# EAGLE board BT60-soldered (EAGLE 9.6.2), part 1 of 2
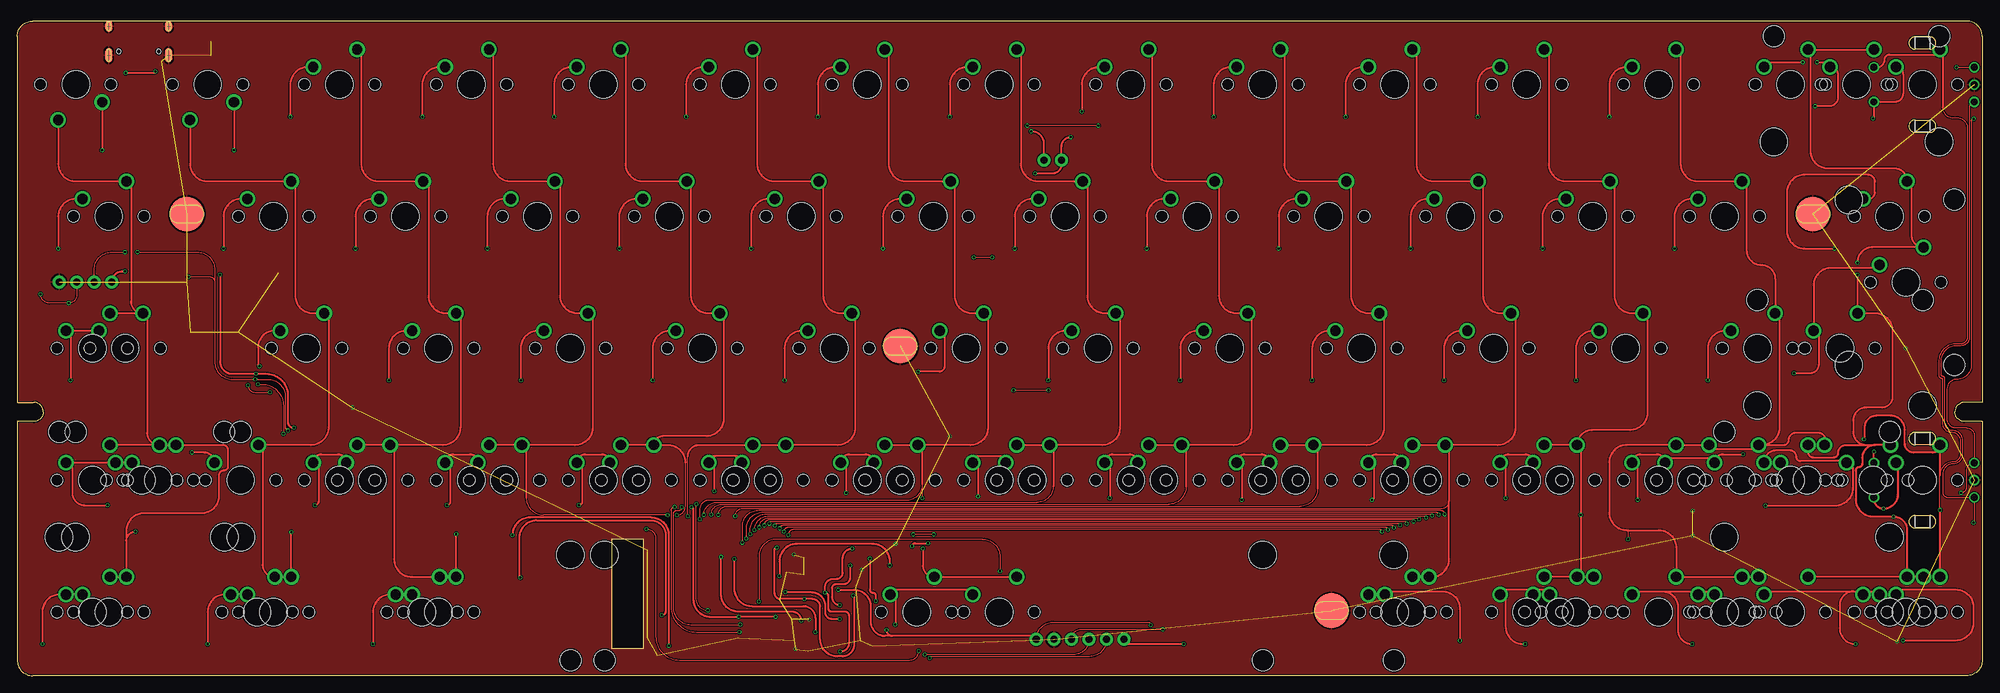
[diagram p2: board, top side]
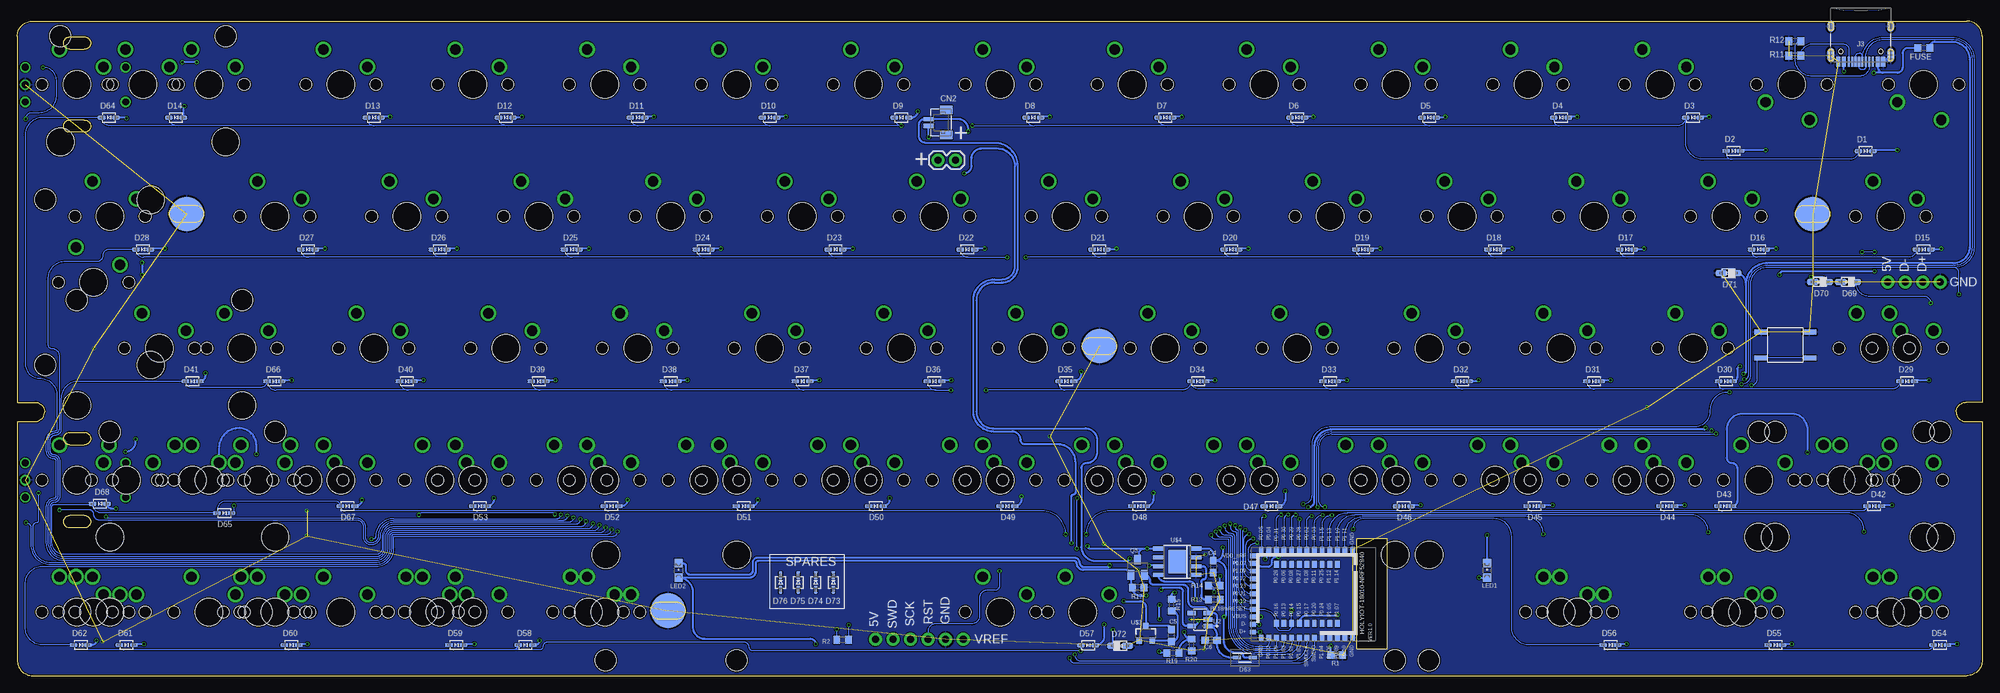
[diagram p3: board, bottom side, seen from below]

Size 283.78 x 94.59 mm. Coordinates in mm from the lower left corner, seen from the top.
Outline: 281.57,94.59 2.21,94.59 arc90 0,92.38 0,39.5 2.36,39.5 arc-90 3.76,38.1 arc-90 2.36,36.7 0,36.7 0,2.21 arc90 2.21,0 281.57,0 arc90 283.78,2.21 283.78,36.7 281.24,36.7 arc-90 279.84,38.1 arc-90 281.24,39.5 283.78,39.5 283.78,92.38 arc90 281.57,94.59
Copper layers (1*16): Top 0.035559375mm / dielectric 1.6mm / Bottom 0.035559375mm
Design rules "jlcpcb2layer": minimum track width 5mil, minimum drill 12mil, track to track 5mil, track to pad 5mil, pad to pad 5mil, via to via 5mil, smd to smd 5mil, copper to edge 8mil, drill to drill 6mil, minimum pad ring 5mil, minimum via ring 3mil, stop-mask expansion 2.5mil, vias tented up to drill 0mil, thermal gap 10mil

## Footprints (pad centres in the part's own frame; a part is rotated, then mirrored left to right if it is on the bottom)
CHERRY-SOLDER = drill 1.499: P$1 -3.81,2.54; P$2 2.54,5.08 | hole 3.988: 0,0 | hole 1.702: -5.08,0; 5.08,0
C0603 = smd 1.1 x 1: 1 -0.85,0; 2 0.85,0
BM02B-SRSS-TB = smd 0.6 x 1.55: 1 0.5,0; 2 -0.5,0 | smd 1.2 x 1.8: M1 1.8,-2.525; M2 -1.8,-2.525
SOD-323 = smd 1.14 x 0.52: A 1.04,0; C -1.04,0
SOD2713X115N = smd 1.125 x 0.5: 1 -1.162,0; 2 1.162,0
SOD-323' = smd 1.676 x 0.813: A 1.04,0; C -1.04,0
R0603 = smd 1 x 1.1: 1 -0.85,0; 2 0.85,0
PCBCOMPONENT_1 = smd 0.7 x 0.9: D+ 5.5,-7.8; D- 4.4,-7.8; P0.07 -4.4,-7.8; P0.12 -2.2,-7.8; P0.18 2.2,-7.8; P0.19 1.1,-7.8; P0.21 0,-7.8; P0.23 -1.1,-7.8; P1.09 -3.3,-7.8; VBUS 3.3,-7.8; VDD_NRF -5.5,-7.8 | smd 0.9 x 0.7: GND -6.35,6.6; GND1 6.35,-6.6; GND2 6.35,6.6; P0.02 -6.35,0; P0.03 -6.35,1.1; P0.04 -6.35,-5.5; P0.05 -6.35,-6.6; P0.09 6.35,4.4; P0.10 6.35,5.5; P0.22 6.35,-5.5; P0.28 -6.35,-1.1; P0.29 -6.35,-2.2; P0.30 -6.35,-3.3; P0.31 -6.35,-4.4; P1.00 6.35,-4.4; P1.01 6.35,-2.2; P1.02 6.35,-1.1; P1.03 6.35,-3.3; P1.04 6.35,2.2; P1.06 6.35,3.3; P1.10 -6.35,4.4; P1.11 -6.35,5.5; P1.13 -6.35,3.3; P1.15 -6.35,2.2; SWDCLK 6.35,0; SWDIO 6.35,1.1 | smd 1 x 0.7: P0.06 -4.25,-3.3; P0.08 -4.25,-2.2; P0.11 -4.25,1.1; P0.13 4.25,-3.3; P0.14 4.25,-2.2; P0.15 4.25,-1.1; P0.16 4.25,-4.4; P0.17 4.25,0; P0.25 -4.25,2.2; P0.26 -4.25,-4.4; P0.27 -4.25,-1.1; P1.05 4.25,3.3; P1.07 4.25,4.4; P1.08 -4.25,0; P1.12 -4.25,3.3; P1.14 -4.25,4.4 | smd 1 x 0.6: P0.20 4.25,1.1; P0.24 4.25,2.2
1X04_NO_SILK = drill 1.016 pad 1.88: 1 0,0; 2 2.54,0; 3 5.08,0; 4 7.62,0
SPARKFUN-CONNECTORS_USB-C-16P = smd 0.3 x 1.45: A5 -1.25,0; A6 -0.25,0; A7 0.25,0; A8 1.25,0; B5 1.75,0; B6 0.75,0; B7 -0.75,0; B8 -1.75,0 | smd 0.6 x 1.45: GND -3.225,0; GND2 3.225,0 | smd 1 x 2.1: SHLD1 -4.32,-0.915; SHLD2 4.32,-0.915 | smd 1 x 2.1 bottom: SHLD3 -4.32,-0.915; SHLD4 4.32,-0.915 | smd 1 x 1.6: SHLD5 -4.32,-5.095; SHLD8 4.32,-5.095 | smd 1 x 1.6 bottom: SHLD6 -4.32,-5.095; SHLD7 4.32,-5.095 | smd 0.55 x 1.45: VBUS1 -2.45,0; VBUS2 2.45,0 | hole 0.65: -2.89,-1.445; 2.89,-1.445
1X02 = drill 1.016 pad 1.88: 1 0,0; 2 2.54,0
CHIPLED_0805 = smd 1.2 x 1.2: A 0,-1.05; C 0,1.05
1X06_NO_SILK = drill 1.016 pad 1.88: 1 0,0; 2 2.54,0; 3 5.08,0; 4 7.62,0; 5 10.16,0; 6 12.7,0
SOT23 = smd 1 x 1.4: 1 -0.95,-1.1; 2 0.95,-1.1; 3 0,1.1
SOT95P285X140-5N = smd 1.35 x 0.6: 1 -1.185,0.95; 2 -1.185,0; 3 -1.185,-0.95; 4 1.185,-0.95; 5 1.185,0.95
CHERRY-ENCODER = drill 0.991: A -2.5,-7.5; B 2.5,-7.5; GND 0,-7.5; S1 -2.5,7; S2 2.5,7
SOT23-3 = smd 0.8 x 0.9: 1 -0.95,-1; 2 0.95,-1; 3 0,1.1
SOIC8 = smd 0.6 x 1.5: 1 -1.905,-2.75; 2 -0.635,-2.75; 3 0.635,-2.75; 4 1.905,-2.75; 5 1.905,2.75; 6 0.635,2.75; 7 -0.635,2.75; 8 -1.905,2.75 | smd 3.4 x 2.5: P$1 0,0
SMD-BUTTON = smd 2 x 0.75: A -3.5,1.875; B 3.5,1.875; C -3.5,-1.875; D 3.5,-1.875
2.5MM_ELONGATED = smd 5 x 5: P$1 0,0 | smd 5 x 5 bottom: P$2 0,0
STAB-2U = hole 3.988: -11.938,-8.255; 11.938,-8.255 | hole 3.048: -11.938,6.985; 11.938,6.985
STAB-6.25U = hole 3.988: -50,-8.255; 50,-8.255 | hole 3.048: -50,6.985; 50,6.985
STAB-7U = hole 3.988: -57,-8.255; 57,-8.255 | hole 3.048: -57,6.985; 57,6.985

## Placement (x,y rotation side)
0  CHERRY-SOLDER  [CHERRY-SOLDER]  198.95,85.39 0 top
1  CHERRY-SOLDER  [CHERRY-SOLDER]  27.5,85.39 180 top
1U_1  CHERRY-SOLDER  [CHERRY-SOLDER]  198.95,9.19 0 top
1U_2  CHERRY-SOLDER  [CHERRY-SOLDER]  218,9.19 0 top
1U_3  CHERRY-SOLDER  [CHERRY-SOLDER]  237.05,9.19 0 top
1U_4  CHERRY-SOLDER  [CHERRY-SOLDER]  256.1,9.19 0 top
1U_5  CHERRY-SOLDER  [CHERRY-SOLDER]  275.15,9.19 0 top
2  CHERRY-SOLDER  [CHERRY-SOLDER]  46.55,85.39 0 top
3  CHERRY-SOLDER  [CHERRY-SOLDER]  65.6,85.39 0 top
4  CHERRY-SOLDER  [CHERRY-SOLDER]  84.65,85.39 0 top
5  CHERRY-SOLDER  [CHERRY-SOLDER]  103.7,85.39 0 top
6  CHERRY-SOLDER  [CHERRY-SOLDER]  122.75,85.39 0 top
7  CHERRY-SOLDER  [CHERRY-SOLDER]  141.8,85.39 0 top
8  CHERRY-SOLDER  [CHERRY-SOLDER]  160.85,85.39 0 top
9  CHERRY-SOLDER  [CHERRY-SOLDER]  179.9,85.39 0 top
#_ISO  CHERRY-SOLDER  [CHERRY-SOLDER]  32.26,28.24 0 top
'  CHERRY-SOLDER  [CHERRY-SOLDER]  232.28,47.29 0 top
,  CHERRY-SOLDER  [CHERRY-SOLDER]  184.66,28.24 0 top
,_1  CHERRY-SOLDER  [CHERRY-SOLDER]  179.9,28.24 0 top
-  CHERRY-SOLDER  [CHERRY-SOLDER]  218,85.39 0 top
.  CHERRY-SOLDER  [CHERRY-SOLDER]  203.71,28.24 0 top
._1  CHERRY-SOLDER  [CHERRY-SOLDER]  198.95,28.24 0 top
/  CHERRY-SOLDER  [CHERRY-SOLDER]  222.76,28.24 0 top
/_1  CHERRY-SOLDER  [CHERRY-SOLDER]  218,28.24 0 top
=  CHERRY-SOLDER  [CHERRY-SOLDER]  237.05,85.39 0 top
[  CHERRY-SOLDER  [CHERRY-SOLDER]  227.52,66.34 0 top
\  CHERRY-SOLDER  [CHERRY-SOLDER]  270.38,66.34 0 top
]  CHERRY-SOLDER  [CHERRY-SOLDER]  246.57,66.34 0 top
A  CHERRY-SOLDER  [CHERRY-SOLDER]  41.78,47.29 0 top
B  CHERRY-SOLDER  [CHERRY-SOLDER]  127.51,28.24 0 top
B_1  CHERRY-SOLDER  [CHERRY-SOLDER]  122.75,28.24 0 top
BS  CHERRY-SOLDER  [CHERRY-SOLDER]  265.62,85.39 0 top
C  CHERRY-SOLDER  [CHERRY-SOLDER]  89.41,28.24 0 top
C4  10u  [C0603]  111.06,15.76 270 bottom
C5  100n  [C0603]  117.06,5.8 90 bottom
C6  4.7u  [C0603]  111.37,5.12 180 bottom
C_1  CHERRY-SOLDER  [CHERRY-SOLDER]  84.65,28.24 0 top
CAPS  CHERRY-SOLDER  [CHERRY-SOLDER]  15.59,47.29 0 top
CAPS_STEP  CHERRY-SOLDER  [CHERRY-SOLDER]  10.83,47.29 0 top
CN2  BM02B-SRSS-TB  [BM02B-SRSS-TB]  152.13,79.92 90 bottom
COLON  CHERRY-SOLDER  [CHERRY-SOLDER]  213.23,47.29 0 top
D  CHERRY-SOLDER  [CHERRY-SOLDER]  79.88,47.29 0 top
D1  1N4148WS  [SOD-323]  16.84,75.79 0 bottom
D2  1N4148WS  [SOD-323]  35.94,75.82 0 bottom
D3  1N4148WS  [SOD-323]  41.78,80.63 0 bottom
D4  1N4148WS  [SOD-323]  60.83,80.63 0 bottom
D5  1N4148WS  [SOD-323]  79.88,80.63 0 bottom
D6  1N4148WS  [SOD-323]  98.93,80.63 0 bottom
D7  1N4148WS  [SOD-323]  117.98,80.63 0 bottom
D8  1N4148WS  [SOD-323]  137.03,80.63 0 bottom
D9  1N4148WS  [SOD-323]  156.08,80.63 0 bottom
D10  1N4148WS  [SOD-323]  175.13,80.63 0 bottom
D11  1N4148WS  [SOD-323]  194.18,80.63 0 bottom
D12  1N4148WS  [SOD-323]  213.23,80.63 0 bottom
D13  1N4148WS  [SOD-323]  232.28,80.63 0 bottom
D14  1N4148WS  [SOD-323]  260.86,80.63 0 bottom
D15  1N4148WS  [SOD-323]  8.45,61.58 0 bottom
D16  1N4148WS  [SOD-323]  32.26,61.58 0 bottom
D17  1N4148WS  [SOD-323]  51.31,61.58 0 bottom
D18  1N4148WS  [SOD-323]  70.36,61.58 0 bottom
D19  1N4148WS  [SOD-323]  89.41,61.58 0 bottom
D20  1N4148WS  [SOD-323]  108.46,61.58 0 bottom
D21  1N4148WS  [SOD-323]  127.51,61.58 0 bottom
D22  1N4148WS  [SOD-323]  146.56,61.58 0 bottom
D23  1N4148WS  [SOD-323]  165.61,61.58 0 bottom
D24  1N4148WS  [SOD-323]  184.66,61.58 0 bottom
D25  1N4148WS  [SOD-323]  203.71,61.58 0 bottom
D26  1N4148WS  [SOD-323]  222.76,61.58 0 bottom
D27  1N4148WS  [SOD-323]  241.81,61.58 0 bottom
D28  1N4148WS  [SOD-323]  265.62,61.58 0 bottom
D29  1N4148WS  [SOD-323]  10.83,42.53 0 bottom
D30  1N4148WS  [SOD-323]  37.02,42.53 0 bottom
D31  1N4148WS  [SOD-323]  56.07,42.53 0 bottom
D32  1N4148WS  [SOD-323]  75.12,42.53 0 bottom
D33  1N4148WS  [SOD-323]  94.17,42.53 0 bottom
D34  1N4148WS  [SOD-323]  113.22,42.53 0 bottom
D35  1N4148WS  [SOD-323]  132.27,42.53 0 bottom
D36  1N4148WS  [SOD-323]  151.32,42.53 0 bottom
D37  1N4148WS  [SOD-323]  170.37,42.53 0 bottom
D38  1N4148WS  [SOD-323]  189.42,42.53 0 bottom
D39  1N4148WS  [SOD-323]  208.47,42.53 0 bottom
D40  1N4148WS  [SOD-323]  227.52,42.53 0 bottom
D41  1N4148WS  [SOD-323]  258.48,42.53 0 bottom
D42  1N4148WS  [SOD-323]  15.59,24.5 0 bottom
D43  1N4148WS  [SOD-323]  37.12,24.5 0 bottom
D44  1N4148WS  [SOD-323]  45.5,24.5 0 bottom
D45  1N4148WS  [SOD-323]  64.66,24.5 0 bottom
D46  1N4148WS  [SOD-323]  83.53,24.47 0 bottom
D47  1N4148WS  [SOD-323]  102.65,24.47 0 bottom
D48  1N4148WS  [SOD-323]  121.75,24.5 0 bottom
D49  1N4148WS  [SOD-323]  140.78,24.5 0 bottom
D50  1N4148WS  [SOD-323]  159.78,24.5 0 bottom
D51  1N4148WS  [SOD-323]  178.88,24.5 0 bottom
D52  1N4148WS  [SOD-323]  197.95,24.5 0 bottom
D53  1N4148WS  [SOD-323]  216.96,24.5 0 bottom
D54  1N4148WS  [SOD-323]  6.06,4.43 0 bottom
D55  1N4148WS  [SOD-323]  29.88,4.43 0 bottom
D56  1N4148WS  [SOD-323]  53.69,4.43 0 bottom
D57  1N4148WS  [SOD-323]  129.14,4.38 0 bottom
D58  1N4148WS  [SOD-323]  210.38,4.43 0 bottom
D59  1N4148WS  [SOD-323]  220.38,4.43 0 bottom
D60  1N4148WS  [SOD-323]  244.19,4.43 0 bottom
D61  1N4148WS  [SOD-323]  268,4.43 0 bottom
D62  1N4148WS  [SOD-323]  274.61,4.43 0 bottom
D63  SD103AWS-E3-08  [SOD2713X115N]  106.48,2.59 0 bottom
D64  1N4148WS  [SOD-323]  270.55,80.63 0 bottom
D65  1N4148WS  [SOD-323]  253.89,23.48 0 bottom
D66  1N4148WS  [SOD-323]  246.65,42.53 0 bottom
D67  1N4148WS  [SOD-323]  236.08,24.5 0 bottom
D68  1N4148WS  [SOD-323]  271.87,24.83 0 bottom
D69  ESDSOD323  [SOD-323']  19.37,56.88 180 bottom
D70  ESDSOD323  [SOD-323']  23.43,56.88 180 bottom
D71  ESDSOD323  [SOD-323']  36.64,58.15 180 bottom
D72  ESDSOD323  [SOD-323']  124.52,4.31 0 bottom
D73  1N4148WS  [SOD-323]  165.93,13.45 270 bottom
D74  1N4148WS  [SOD-323]  168.47,13.45 270 bottom
D75  1N4148WS  [SOD-323]  171.01,13.45 270 bottom
D76  1N4148WS  [SOD-323]  173.55,13.45 270 bottom
E  CHERRY-SOLDER  [CHERRY-SOLDER]  75.12,66.34 0 top
ENTER  CHERRY-SOLDER  [CHERRY-SOLDER]  263.24,47.29 0 top
ESC  CHERRY-SOLDER  [CHERRY-SOLDER]  8.45,85.39 180 top
EXTRA_1U_LEFT  CHERRY-SOLDER  [CHERRY-SOLDER]  241.81,28.24 0 top
F  CHERRY-SOLDER  [CHERRY-SOLDER]  98.93,47.29 0 top
FN  CHERRY-SOLDER  [CHERRY-SOLDER]  272.76,9.19 0 top
FUSE  500m  [R0603]  8.45,90.69 180 bottom
G  CHERRY-SOLDER  [CHERRY-SOLDER]  117.98,47.29 0 top
H  CHERRY-SOLDER  [CHERRY-SOLDER]  137.03,47.29 0 top
I  CHERRY-SOLDER  [CHERRY-SOLDER]  170.4,66.34 0 top
IC3  HOLYIOT_18010  [PCBCOMPONENT_1]  97.52,11.8 270 bottom
ISO_#  CHERRY-SOLDER  [CHERRY-SOLDER]  251.33,47.29 0 top
ISO_ENTER  CHERRY-SOLDER  [CHERRY-SOLDER]  272.76,56.82 0 top
J  CHERRY-SOLDER  [CHERRY-SOLDER]  156.08,47.29 0 top
J1  [1X04_NO_SILK]  6.03,56.88 0 top
J3  [SPARKFUN-CONNECTORS_USB-C-16P]  17.54,88.73 180 bottom
J4  [1X02]  150.82,74.49 0 bottom
K  CHERRY-SOLDER  [CHERRY-SOLDER]  175.13,47.29 0 top
L  CHERRY-SOLDER  [CHERRY-SOLDER]  194.18,47.29 0 top
L_1.25U_SHIFT  CHERRY-SOLDER  [CHERRY-SOLDER]  10.83,28.24 0 top
L_2U_SHIFT  CHERRY-SOLDER  [CHERRY-SOLDER]  17.97,28.24 0 top
L_SHIFT  CHERRY-SOLDER  [CHERRY-SOLDER]  20.35,28.24 0 top
LALT  CHERRY-SOLDER  [CHERRY-SOLDER]  58.45,9.19 0 top
LALT_1.5U  CHERRY-SOLDER  [CHERRY-SOLDER]  60.83,9.19 0 top
LCTRL  CHERRY-SOLDER  [CHERRY-SOLDER]  10.83,9.19 0 top
LCTRL_1.5U  CHERRY-SOLDER  [CHERRY-SOLDER]  13.21,9.19 0 top
LED1  [CHIPLED_0805]  71.5,15.23 0 bottom
LED2  [CHIPLED_0805]  188.28,15.23 0 bottom
LWIN  CHERRY-SOLDER  [CHERRY-SOLDER]  34.64,9.19 0 top
LWIN_1U  CHERRY-SOLDER  [CHERRY-SOLDER]  37.02,9.19 0 top
M  CHERRY-SOLDER  [CHERRY-SOLDER]  165.61,28.24 0 top
M_1  CHERRY-SOLDER  [CHERRY-SOLDER]  160.85,28.24 0 top
MENU  CHERRY-SOLDER  [CHERRY-SOLDER]  225.14,9.19 0 top
MENU_1U  CHERRY-SOLDER  [CHERRY-SOLDER]  246.57,9.19 0 top
N  CHERRY-SOLDER  [CHERRY-SOLDER]  146.56,28.24 0 top
N_1  CHERRY-SOLDER  [CHERRY-SOLDER]  141.8,28.24 0 top
O  CHERRY-SOLDER  [CHERRY-SOLDER]  189.42,66.34 0 top
P  CHERRY-SOLDER  [CHERRY-SOLDER]  208.47,66.34 0 top
PROG1  [1X06_NO_SILK]  147.16,5.25 0 top
Q  CHERRY-SOLDER  [CHERRY-SOLDER]  37.02,66.34 0 top
Q5  PMOSFET  [SOT23]  121.97,15.67 0 bottom
R  CHERRY-SOLDER  [CHERRY-SOLDER]  94.17,66.34 0 top
R1  1k  [R0603]  93.23,2.96 180 bottom
R2  10k  [R0603]  164.58,5.17 180 bottom
R11  5.1k  [R0603]  27.06,89.58 0 bottom
R12  5.1k  [R0603]  27.06,91.67 0 bottom
R13  2k  [R0603]  110.9,10.99 180 bottom
R14  1k  [R0603]  110.9,13.04 180 bottom
R15  100  [R0603]  117.07,10.2 90 bottom
R17  100k  [R0603]  121.9,12.73 180 bottom
R19  2k  [R0603]  116.88,3.26 0 bottom
R20  2k  [R0603]  114.18,4.43 270 bottom
R_ALT_1.5  CHERRY-SOLDER  [CHERRY-SOLDER]  222.76,9.19 0 top
R_CTRL_1.5U  CHERRY-SOLDER  [CHERRY-SOLDER]  270.38,9.19 0 top
R_SHIFT  CHERRY-SOLDER  [CHERRY-SOLDER]  258.48,28.24 0 top
R_SHIFT_1.75U_LEFT  CHERRY-SOLDER  [CHERRY-SOLDER]  248.95,28.24 0 top
R_SHIFT_1.75U_RIGHT  CHERRY-SOLDER  [CHERRY-SOLDER]  268,28.24 0 top
RALT  CHERRY-SOLDER  [CHERRY-SOLDER]  201.33,9.19 0 top
RCTRL  CHERRY-SOLDER  [CHERRY-SOLDER]  248.95,9.19 0 top
S  CHERRY-SOLDER  [CHERRY-SOLDER]  60.83,47.29 0 top
SPACE_6.25U  CHERRY-SOLDER  [CHERRY-SOLDER]  129.89,9.19 0 top
SPACE_7U  CHERRY-SOLDER  [CHERRY-SOLDER]  141.8,9.19 0 top
SPLIT_BS_1  CHERRY-SOLDER  [CHERRY-SOLDER]  256.1,85.39 0 top
SPLIT_BS_2  CHERRY-SOLDER  [CHERRY-SOLDER]  275.15,85.39 0 top
T  CHERRY-SOLDER  [CHERRY-SOLDER]  113.22,66.34 0 top
TAB  CHERRY-SOLDER  [CHERRY-SOLDER]  13.21,66.34 0 top
U  CHERRY-SOLDER  [CHERRY-SOLDER]  151.32,66.34 0 top
U2  AP2112K-3.3TRG1  [SOT95P285X140-5N]  112.99,8.12 180 bottom
U$1  CHERRY-ENCODER  [CHERRY-ENCODER]  275.15,85.39 90 top
U$2  CHERRY-ENCODER  [CHERRY-ENCODER]  275.15,28.24 90 top
U$3  XB3303ASOT23  [SOT23-3]  120.79,6.08 0 bottom
U$4  TP4056SOI8  [SOIC8]  116.27,16.45 90 bottom
U$62  SMD-BUTTON  [SMD-BUTTON]  28.44,47.77 0 bottom
U$64  2.5MM_ELONGATED  [2.5MM_ELONGATED]  189.8,9.4 0 top
U$65  2.5MM_ELONGATED  [2.5MM_ELONGATED]  259.35,66.71 0 top
U$66  2.5MM_ELONGATED  [2.5MM_ELONGATED]  127.5,47.6 0 top
U$67  2.5MM_ELONGATED  [2.5MM_ELONGATED]  24.5,66.69 0 top
U$68  STAB-2U  [STAB-2U]  20.35,28.24 0 top
U$69  STAB-2U  [STAB-2U]  263.24,47.29 0 top
U$70  STAB-2U  [STAB-2U]  265.62,85.39 0 top
U$71  STAB-2U  [STAB-2U]  258.48,28.24 0 top
U$72  STAB-6U  [STAB-6.25U]  129.89,9.19 180 top
U$83  STAB-2U  [STAB-2U]  272.76,56.82 270 top
U$91  STAB-7U  [STAB-7U]  141.8,9.19 180 top
U$108  STAB-2U  [STAB-2U]  17.97,28.24 0 top
UP  CHERRY-SOLDER  [CHERRY-SOLDER]  237.05,28.24 0 top
V  CHERRY-SOLDER  [CHERRY-SOLDER]  108.46,28.24 0 top
V_1  CHERRY-SOLDER  [CHERRY-SOLDER]  103.7,28.24 0 top
W  CHERRY-SOLDER  [CHERRY-SOLDER]  56.07,66.34 0 top
X  CHERRY-SOLDER  [CHERRY-SOLDER]  70.36,28.24 0 top
X5U_1  CHERRY-SOLDER  [CHERRY-SOLDER]  256.1,28.24 0 top
X5U_2  CHERRY-SOLDER  [CHERRY-SOLDER]  275.15,28.24 0 top
X_1  CHERRY-SOLDER  [CHERRY-SOLDER]  65.6,28.24 0 top
Y  CHERRY-SOLDER  [CHERRY-SOLDER]  132.27,66.34 0 top
Z  CHERRY-SOLDER  [CHERRY-SOLDER]  51.31,28.24 0 top
Z_1  CHERRY-SOLDER  [CHERRY-SOLDER]  46.55,28.24 0 top